# EAGLE design Epaper_bob (EAGLE 8.6.0)
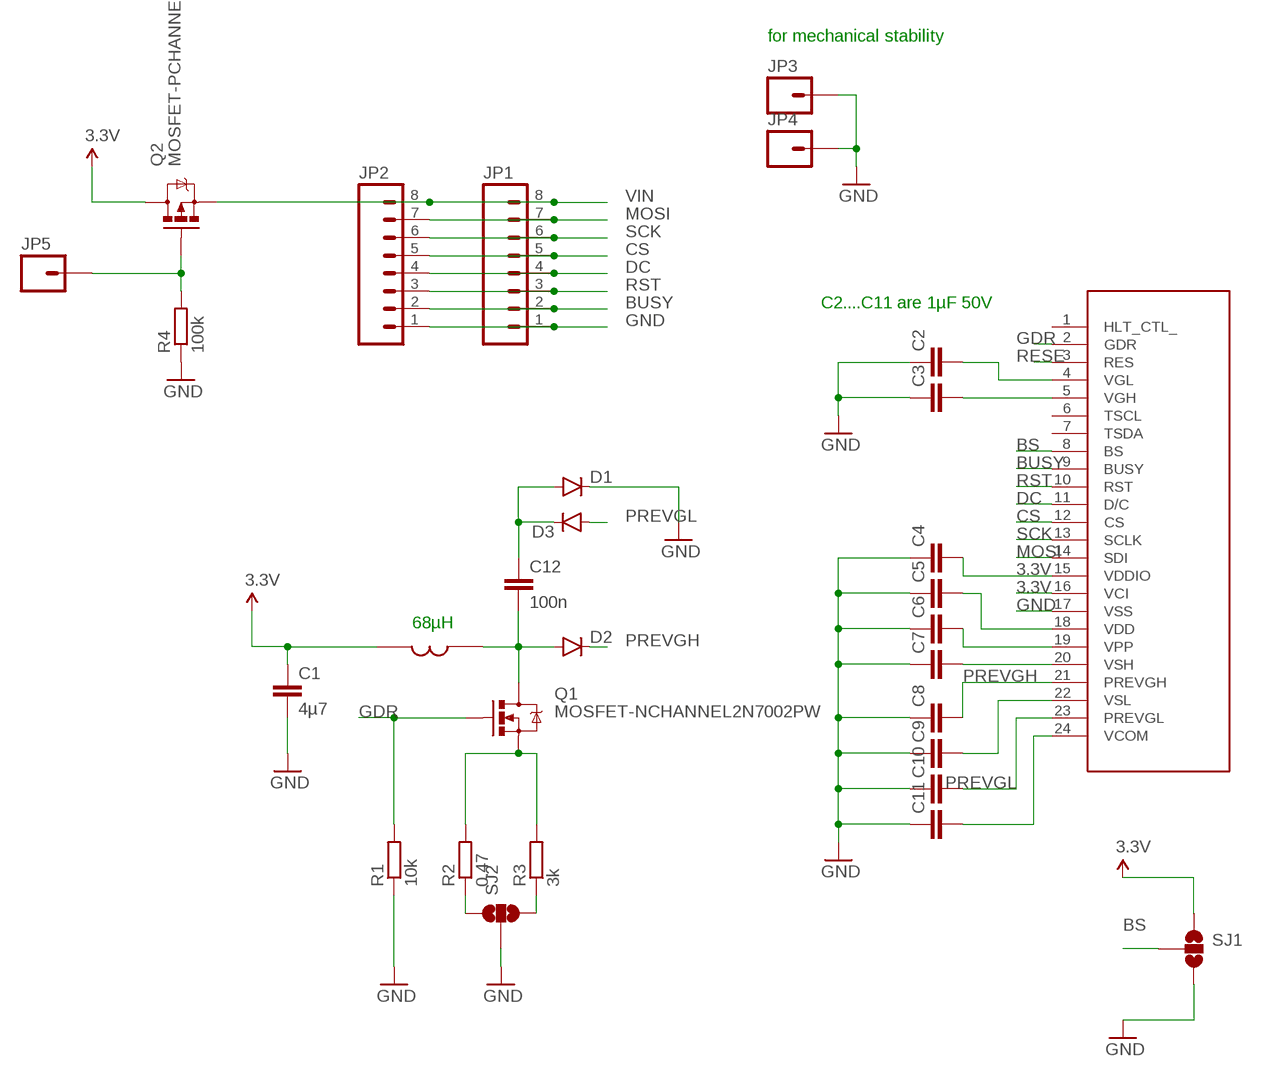
[diagram p0: schematic, sheet 1]

## Parts
C1  4µ7  C-EUC0603  [C0603]
C2  C-EUC0603  [C0603]
C3  C-EUC0603  [C0603]
C4  C-EUC0603  [C0603]
C5  C-EUC0603  [C0603]
C6  C-EUC0603  [C0603]
C7  C-EUC0603  [C0603]
C8  C-EUC0603  [C0603]
C9  C-EUC0603  [C0603]
C10  C-EUC0603  [C0603]
C11  C-EUC0603  [C0603]
C12  100n  C-EUC0603  [C0603]
D1  DIODESOD123  [SOD-123]
D2  DIODESOD123  [SOD-123]
D3  DIODESOD123  [SOD-123]
JP1  M08NO_SILK  [1X08_PIN1_NO_SILK]
JP2  M08  [1X08_ROUND]
JP3  M01PTH_NO_SILK_YES_STOP  [1X01_NO_SILK]
JP4  M01PTH_NO_SILK_YES_STOP  [1X01_NO_SILK]
JP5  M01PTH_NO_SILK_YES_STOP  [1X01_NO_SILK]
Q1  MOSFET-NCHANNEL2N7002PW  [SOT323]
Q2  MOSFET-PCHANNEL  [SOT23-3]
R1  10k  R-EU_R0603  [R0603]
R2  0.47  R-EU_R0603  [R0603]
R3  3k  R-EU_R0603  [R0603]
R4  100k  R-EU_R0603  [R0603]
SJ1  SOLDERJUMPER_2WAYS  [SJ_3]
SJ2  SOLDERJUMPER_2WAYS  [SJ_3]
U$1  E-PAPER  [FPC24]
U$2  LQH3_INDUCTOR  [LQH3_INDUCTOR]

## Nets
3.3V: C1.1 C4.2 Q2.3(D) SJ1.1 U$1.15(VDDIO) U$1.16(VCI) U$2.P$1
BS: SJ1.2 U$1.8(BS)
BUSY: JP1.2 JP2.2 U$1.9(BUSY)
CS: JP1.5 JP2.5 U$1.12(CS)
DC: JP1.4 JP2.4 U$1.11(D/C)
GDR: Q1.1(G) R1.2 U$1.2(GDR)
GND: C1.2 C2.1 C3.1 C4.1 C5.1 C6.1 C7.1 C8.1 C9.1 C10.1 C11.1 D1.C JP1.1 JP2.1 JP3.1 JP4.1 R1.1 R4.1 SJ1.3 SJ2.2 U$1.17(VSS)
MOSI: JP1.7 JP2.7 U$1.14(SDI)
N$1: C11.2 U$1.24(VCOM)
N$2: C2.2 U$1.4(VGL)
N$3: C9.2 U$1.22(VSL)
N$4: C3.2 U$1.5(VGH)
N$5: C7.2 U$1.20(VSH)
N$6: C6.2 U$1.19(VPP)
N$7: C5.2 U$1.18(VDD)
N$8: R2.1 SJ2.1
N$9: R3.1 SJ2.3
N$10: Q1.2(S) R2.2 R3.2
N$11: JP5.1 Q2.1(G) R4.2
N$13: C12.2 D2.A Q1.3(D) U$2.P$2
N$14: C12.1 D1.A D3.C
PREVGH: C8.2 D2.C U$1.21(PREVGH)
PREVGL: C10.2 D3.A U$1.23(PREVGL)
RESE: U$1.3(RES)
RST: JP1.3 JP2.3 U$1.10(RST)
SCK: JP1.6 JP2.6 U$1.13(SCLK)
VIN: JP1.8 JP2.8 Q2.2(S)
Unconnected: U$1.1(HLT_CTL_) U$1.6(TSCL) U$1.7(TSDA)

## Notes on the sheet
- for mechanical stability
- C2....C11 are 1µF 50V
- 68µH

## Library data of the parts
C1-C12 = rcl:C-EU: CAPACITOR, European symbol
D1-D3 = SparkFun-DiscreteSemi:DIODE: Diode These are standard reverse protection diodes and small signal diodes. SMA package can handle up to about 1A. SOD-323 can handle about 200mA. What the SOD-323 package when ordering, there are some mfgs out there that are 5-pin packages.
JP1 JP2 = SparkFun-Connectors:M08: Header 8 Standard 8-pin 0.1" header. Use with straight break away headers (SKU : PRT-00116), right angle break away headers (PRT-00553), swiss pins (PRT-00743), machine pins (PRT-00117), and female headers (PRT-00115).
JP3-JP5 = SparkFun-Connectors:M01: Header 1 Standard 1-pin 0.1" header. Use with straight break away headers (SKU : PRT-00116), right angle break away headers (PRT-00553), swiss pins (PRT-00743), machine pins (PRT-00117), and female headers (PRT-00115). SMTSO-256-ET is a "flush mount" nut for a 4-40 screw. The older package used to be too tight, and did not allow it to sit properly thru the drill hit. The latest (0.165DIA) fits nice and snug.
Q1 = SparkFun-DiscreteSemi:MOSFET-NCHANNEL: Common NMOSFET Parts MFG P/N Store ID Prod ID FDD8780 TRANS-09984 SI7820DN TRANS-11055 FDS6630A IC-08089 2N7002PW TRANS-11151 FQP30N06L COM-10213 TRANS-10060 BSS123LT1G TRANS-08345 BSS138 TRANS-00830 BS170 2N7000; PROD_ID: TRANS-11151
Q2 = SparkFun-DiscreteSemi:MOSFET-PCHANNEL: Generic PMOSFET IRLML2244 - TRANS-11153 (SOT-23 -20V -4.3A) (1.Gate 2.Source 3.Drain) FQP27P06 - COM-10349 <http://www.sparkfun.com/products/10349> (TO-220 -60V -27A) (1.Gate 2.Source 3.Drain); PROD_ID: TRANS-08285
R1-R4 = rcl:R-EU_: RESISTOR, European symbol
SJ1 SJ2 = SparkFun-Retired:SOLDERJUMPER_2WAY: Solder Jumper 2 way solder jumper
U$1 = FPC24:E-PAPER
U$2 = LQH3_inductor:LQH3_INDUCTOR

## Board
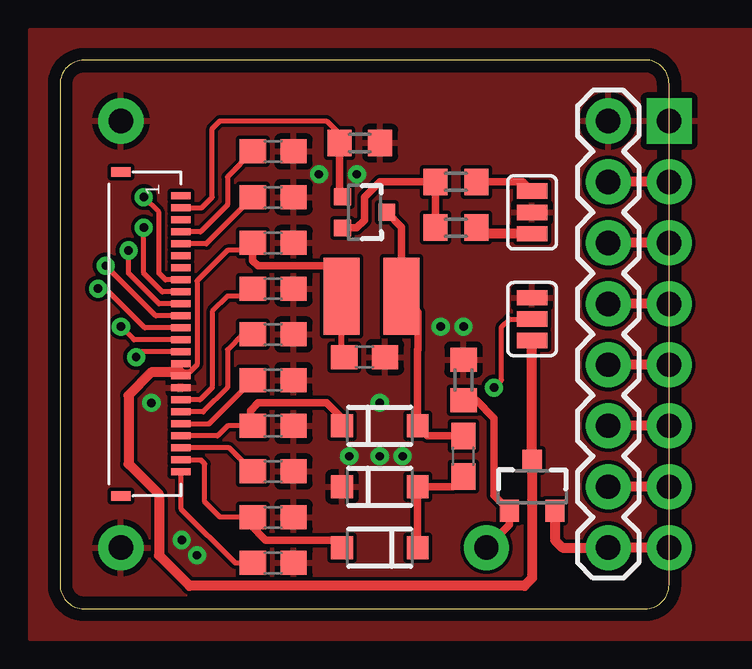
[diagram p1: board, top side]
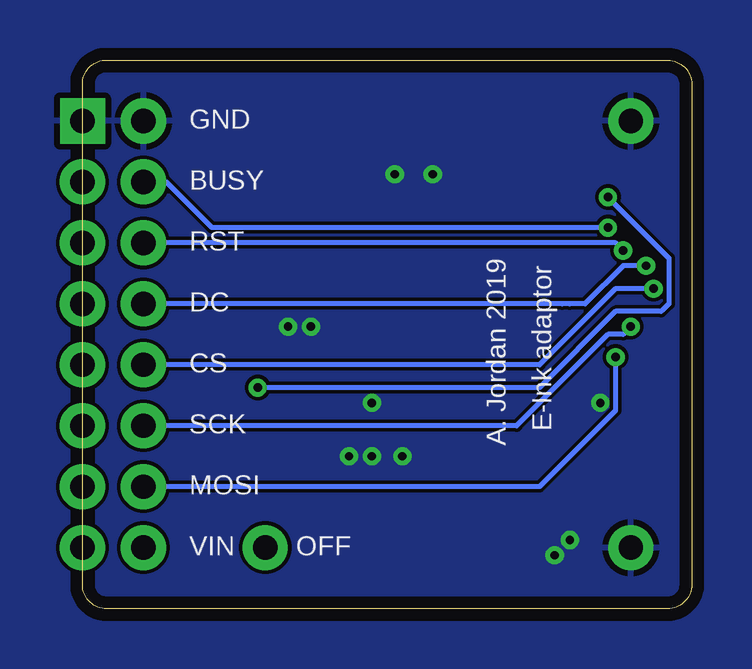
[diagram p2: board, bottom side, seen from below]

Size 25.4 x 22.86 mm. Coordinates in mm from the lower left corner, seen from the top.
Outline: 1,0 24.4,0 arc90 25.4,1 25.4,21.86 arc90 24.4,22.86 1,22.85 arc90 0,21.85 0,1 arc90 1,0
Copper layers (1*16): Top 0.035mm / dielectric 1.5mm / Bottom 0.035mm
Design rules "default *": minimum track width 6mil, minimum drill 0.35mm, track to track 6mil, track to pad 6mil, pad to pad 6mil, via to via 6mil, smd to smd 6mil, copper to edge 20mil, drill to drill 6mil, minimum pad ring 10mil, minimum via ring 8mil, stop-mask expansion 4mil, vias tented up to drill 20mil, thermal gap 10mil

### Footprints (pad centres in the part's own frame; a part is rotated, then mirrored left to right if it is on the bottom)
C0603 = smd 1.1 x 1: 1 -0.85,0; 2 0.85,0
SOD-123 = smd 0.9 x 0.95: A 1.575,0; C -1.575,0
1X08_PIN1_NO_SILK = drill 1.016 pad 1.88 square: 1 0,0 | drill 1.016 pad 1.88: 2 2.54,0; 3 5.08,0; 4 7.62,0; 5 10.16,0; 6 12.7,0; 7 15.24,0; 8 17.78,0
1X08_ROUND = drill 1.016 pad 1.88: 1 0,0; 2 2.54,0; 3 5.08,0; 4 7.62,0; 5 10.16,0; 6 12.7,0; 7 15.24,0; 8 17.78,0
1X01_NO_SILK = drill 1.016 pad 1.88: 1 0,0
SOT323 = smd 0.7 x 0.7: 1 -0.65,-0.925; 2 0.65,-0.925; 3 0,0.925
SOT23-3 = smd 0.8 x 0.9: 1 -0.95,-1; 2 0.95,-1; 3 0,1.1
R0603 = smd 1 x 1.1: 1 -0.85,0; 2 0.85,0
SJ_3 = smd 0.635 x 1.27: 1 -0.889,0; 2 0,0; 3 0.889,0
FPC24 = smd 0.3 x 0.8: 1 1,2.5; 2 1.5,2.5; 3 2,2.5; 4 2.5,2.5; 5 3,2.5; 6 3.5,2.5; 7 4,2.5; 8 4.5,2.5; 9 5,2.5; 10 5.5,2.5; 11 6,2.5; 12 6.5,2.5; 13 7,2.5; 14 7.5,2.5; 15 8,2.5; 16 8.5,2.5; 17 9,2.5; 18 9.5,2.5; 19 10,2.5; 20 10.5,2.5; 21 11,2.5; 22 11.5,2.5; 23 12,2.5; 24 12.5,2.5 | smd 0.4 x 0.8: P$1 0,0; P$2 13.5,0
LQH3_INDUCTOR = smd 1.5 x 3.2: P$1 0,0; P$2 2.5,0

### Placement (x,y rotation side)
C1  12.7,10.48 0 top
C2  8.89,19.05 180 top
C3  8.89,17.14 180 top
C4  8.89,15.24 180 top
C5  8.89,13.34 180 top
C6  8.89,11.43 180 top
C7  8.89,9.53 180 top
C8  8.89,7.62 180 top
C9  8.89,5.71 180 top
C10  8.89,3.81 180 top
C11  8.89,1.91 180 top
C12  16.83,6.35 90 top
D1  13.34,5.08 0 top
D2  13.34,7.62 0 top
D3  13.34,2.54 180 top
JP1  25.4,20.32 270 top
JP2  22.86,20.32 270 top
JP3  2.54,2.54 0 top
JP4  2.54,20.32 0 top
JP5  17.78,2.54 0 top
Q1  12.7,16.51 270 top
Q2  19.68,5.08 0 top
R1  12.5,19.4 180 top
R2  16.51,17.78 180 top
R3  16.51,15.88 180 top
R4  16.83,9.53 270 top
SJ1  19.68,12.06 90 top
SJ2  19.68,16.51 270 top
U$1  2.54,18.2 270 top
U$2  11.75,13.02 0 top

### Tracks (layer width: path | path; a pad name or v marks a point on that pad's centre or on a via)
3.3V
  Top 0.2: U$1.16 5.04,9.84 | 5.04,9.84 U$1.15 | C4.2 7.72,14.92 6.99,14.92 5.71,13.65 5.71,10.16 5.4,9.84 5.04,9.84
  Top 0.254: C1.1 11.75,10.58 U$2.P$1 11.11,13.65 11.11,14.29
  Top 0.305: 11.11,14.29 8.26,14.29 8.04,14.5 C4.2
  Top 0.406: SJ1.1 Q2.3 19.68,1.27 19.37,0.95 5.4,0.95 4.13,2.22 4.13,4.76 2.86,6.03 2.86,8.89 3.81,9.84 5.04,9.84
BS  (via drill 0.35)
  Top 0.2: U$1.8 4.4,13.7 4.13,13.97 4.13,16.51 v3.49,17.14 | v18.1,9.21 18.41,9.53 18.41,11.75 18.73,12.06 SJ1.2
  Bottom 0.2: v3.49,17.14 0.95,14.61 0.95,12.7 1.27,12.38 3.17,12.38 6.35,9.21 v18.1,9.21
BUSY  (via drill 0.35)
  Top 0.2: U$1.9 4.26,13.2 3.49,13.97 v3.49,15.88
  Top 0.406: JP1.2 JP2.2
  Bottom 0.2: v3.49,15.88 20,15.88 21.91,17.78 JP2.2
CS  (via drill 0.35)
  Top 0.2: U$1.12 3.54,11.7 1.91,13.34 v1.59,13.34
  Top 0.406: JP1.5 JP2.5
  Bottom 0.2: v1.59,13.34 3.17,13.34 6.35,10.16 JP2.5
DC  (via drill 0.35)
  Top 0.2: U$1.11 3.99,12.2 v1.91,14.29
  Top 0.406: JP1.4 JP2.4
  Bottom 0.2: v1.91,14.29 2.86,14.29 4.45,12.7 5.08,12.7 5.4,12.69 JP2.4
GDR
  Top 0.2: U$1.2 5.91,16.7 6.35,17.14 6.35,20 6.67,20.32 11.11,20.32 11.65,19.78 11.65,19.37
  Top 0.305: Q1.1 11.65,17.29 11.65,19.37 R1.2
GND  (via drill 0.35)
  other vias: 5.08,2.86 5.71,2.22 15.88,11.75 16.83,11.75 3.81,8.57 10.79,18.1 13.34,6.35 14.29,6.35 12.06,6.35 12.38,18.1 13.34,8.57
  pour Bottom: -2.54,25.4 -2.54,-2.54 34.29,-2.54 34.29,25.4
  pour Top: -1.27,24.13 -1.27,-1.27 33.02,-1.27 33.02,24.13
MOSI  (via drill 0.35)
  Top 0.2: U$1.14 3.4,10.7 v3.17,10.48
  Top 0.406: JP1.7 JP2.7
  Bottom 0.2: v3.17,10.48 3.17,8.26 6.35,5.08 JP2.7
N$1
  Top 0.2: U$1.24 5.04,4.17 7.3,1.91 C11.2
N$2
  Top 0.2: C2.2 6.99,18 6.99,16.83 5.86,15.7 U$1.4
N$3
  Top 0.2: C9.2 7.05,6.7 U$1.22
N$4
  Top 0.2: U$1.5 6.09,15.2 C3.2
N$5
  Top 0.2: U$1.20 6.21,7.7 C7.2
N$6
  Top 0.2: C6.2 7.62,11.43 6.99,10.79 6.99,9.21 5.98,8.2 U$1.19
N$7
  Top 0.2: C5.2 7.72,13.02 6.99,13.02 6.35,12.38 6.35,9.21 5.84,8.7 U$1.18
N$8
  Top 0.305: R2.1 19.3,17.78 SJ2.1
N$9
  Top 0.406: SJ2.3 17.61,15.62 R3.1
N$10
  Top 0.305: Q1.2 12.37,15.86 12.7,16.19 12.7,17.14 13.34,17.78 R2.2 R3.2
N$11
  Top 0.305: R4.2 17.36,8.68 18.1,7.94 18.1,4.72 Q2.1 18.73,3.5 JP5.1
N$13
  Top 0.305: C12.2 15.33,7.2 D2.A 14.91,10.78 14.92,10.79 14.92,12.34 U$2.P$2 14.25,15.89 Q1.3
N$14
  Top 0.305: D3.C D1.A 16.39,5.08 C12.1
PREVGH
  Top 0.2: C8.2 7.94,7.62 6.99,7.62 6.57,7.2 U$1.21
  Top 0.305: D2.C 11.76,7.92 11.11,8.57 8.26,8.57 7.94,8.26 7.94,7.62
PREVGL
  Top 0.2: U$1.23 5.87,6.2 6.03,6.03 6.03,4.45 6.67,3.81 7.94,3.81 C10.2
  Top 0.305: D3.A 11.44,2.86 8.57,2.86 7.94,3.49 7.94,3.81
RST  (via drill 0.35)
  Top 0.2: U$1.10 4.13,12.7 2.86,13.97 v2.86,14.92
  Top 0.406: JP1.3 JP2.3
  Bottom 0.2: v2.86,14.92 3.17,15.24 JP2.3
SCK  (via drill 0.35)
  Top 0.2: U$1.13 3.09,11.2 v2.54,11.75
  Top 0.406: JP1.6 JP2.6
  Bottom 0.2: v2.54,11.75 2.86,11.43 3.49,11.43 7.3,7.62 JP2.6
VIN
  Top 0.406: Q2.2 20.64,2.86 20.95,2.54 JP2.8 JP1.8

### Text on the board
bPlace: GND | BUSY | A. Jordan 2019 | RST | E-Ink adaptor | DC | CS | SCK | MOSI | OFF | VIN